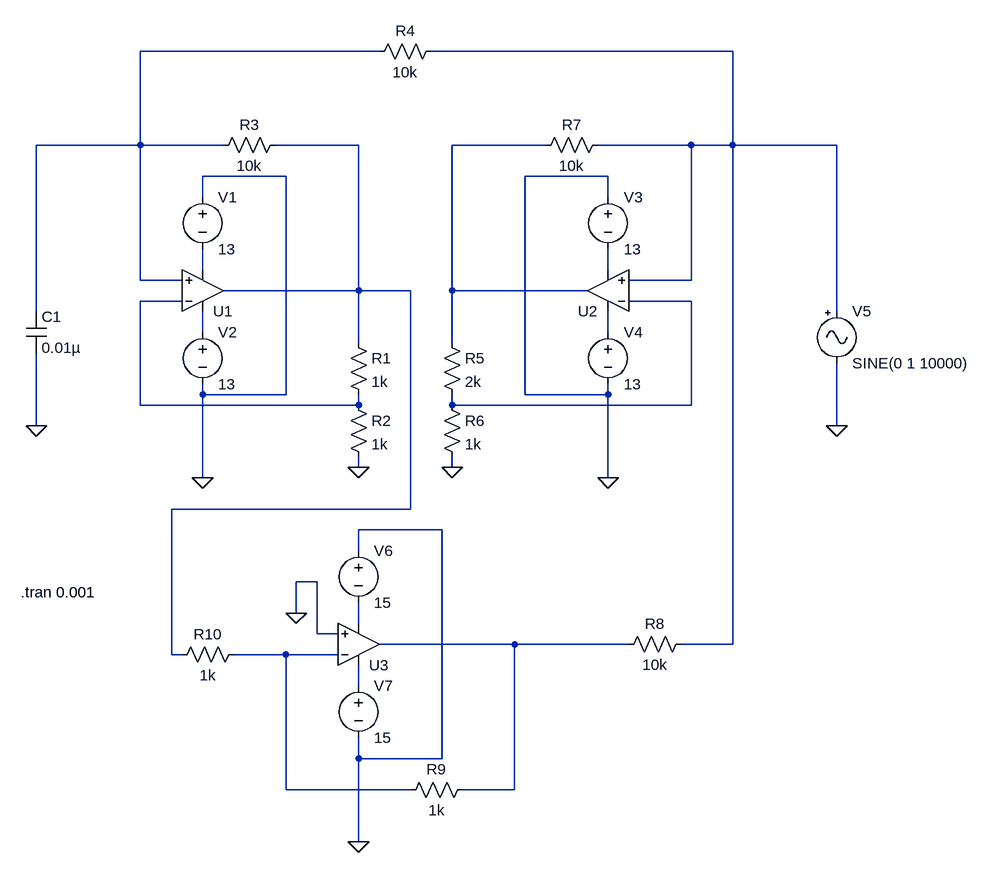
[diagram p0: schematic Gyrator.asc]
Gyrator.asc, the LTspice schematic file:
Version 4
SHEET 1 1372 1112
WIRE 448 -224 80 -224
WIRE 992 -224 528 -224
WIRE 80 -80 80 -224
WIRE 80 -80 -80 -80
WIRE 208 -80 80 -80
WIRE 416 -80 288 -80
WIRE 704 -80 560 -80
WIRE 928 -80 784 -80
WIRE 992 -80 992 -224
WIRE 992 -80 928 -80
WIRE 1152 -80 992 -80
WIRE 304 -32 176 -32
WIRE 800 -32 672 -32
WIRE 176 0 176 -32
WIRE 800 0 800 -32
WIRE 176 112 176 80
WIRE 800 112 800 80
WIRE 80 128 80 -80
WIRE 144 128 80 128
WIRE 928 128 928 -80
WIRE 928 128 832 128
WIRE 416 144 416 -80
WIRE 416 144 208 144
WIRE 496 144 416 144
WIRE 560 144 560 -80
WIRE 768 144 560 144
WIRE 144 160 80 160
WIRE 928 160 832 160
WIRE -80 176 -80 -80
WIRE 1152 176 1152 -80
WIRE 176 208 176 176
WIRE 800 208 800 176
WIRE 416 224 416 144
WIRE 560 224 560 144
WIRE 176 304 176 288
WIRE 304 304 304 -32
WIRE 304 304 176 304
WIRE 672 304 672 -32
WIRE 800 304 800 288
WIRE 800 304 672 304
WIRE 80 320 80 160
WIRE 416 320 416 304
WIRE 416 320 80 320
WIRE 560 320 560 304
WIRE 928 320 928 160
WIRE 928 320 560 320
WIRE -80 352 -80 240
WIRE 1152 352 1152 256
WIRE 416 416 416 400
WIRE 560 416 560 400
WIRE 176 432 176 304
WIRE 800 432 800 304
WIRE 496 480 496 144
WIRE 496 480 128 480
WIRE 544 512 416 512
WIRE 416 544 416 512
WIRE 352 592 320 592
WIRE 320 640 320 592
WIRE 416 656 416 624
WIRE 352 672 352 592
WIRE 384 672 352 672
WIRE 656 688 448 688
WIRE 832 688 656 688
WIRE 992 688 992 -80
WIRE 992 688 912 688
WIRE 128 704 128 480
WIRE 144 704 128 704
WIRE 304 704 224 704
WIRE 384 704 304 704
WIRE 416 752 416 720
WIRE 416 864 416 832
WIRE 544 864 544 512
WIRE 544 864 416 864
WIRE 304 912 304 704
WIRE 496 912 304 912
WIRE 656 912 656 688
WIRE 656 912 576 912
WIRE 416 992 416 864
FLAG 176 432 0
FLAG 800 432 0
FLAG 416 992 0
FLAG 320 640 0
FLAG 560 416 0
FLAG 416 416 0
FLAG 1152 352 0
FLAG -80 352 0
SYMBOL OpAmps\\UniversalOpamp2 176 144 M180
SYMATTR InstName U1
SYMBOL voltage 176 -16 R0
WINDOW 123 0 0 Left 0
WINDOW 39 0 0 Left 0
SYMATTR InstName V1
SYMATTR Value 13
SYMBOL voltage 176 192 R0
WINDOW 123 0 0 Left 0
WINDOW 39 0 0 Left 0
SYMATTR InstName V2
SYMATTR Value 13
SYMBOL res 400 208 R0
SYMATTR InstName R1
SYMATTR Value 1k
SYMBOL res 400 304 R0
SYMATTR InstName R2
SYMATTR Value 1k
SYMBOL res 304 -96 R90
WINDOW 0 0 56 VBottom 2
WINDOW 3 32 56 VTop 2
SYMATTR InstName R3
SYMATTR Value 10k
SYMBOL cap -96 176 R0
SYMATTR InstName C1
SYMATTR Value 0.01µ
SYMBOL res 544 -240 R90
WINDOW 0 0 56 VBottom 2
WINDOW 3 32 56 VTop 2
SYMATTR InstName R4
SYMATTR Value 10k
SYMBOL OpAmps\\UniversalOpamp2 800 144 R180
SYMATTR InstName U2
SYMBOL voltage 800 -16 R0
WINDOW 123 0 0 Left 0
WINDOW 39 0 0 Left 0
SYMATTR InstName V3
SYMATTR Value 13
SYMBOL voltage 800 192 R0
WINDOW 123 0 0 Left 0
WINDOW 39 0 0 Left 0
SYMATTR InstName V4
SYMATTR Value 13
SYMBOL res 544 208 R0
SYMATTR InstName R5
SYMATTR Value 2k
SYMBOL res 544 304 R0
SYMATTR InstName R6
SYMATTR Value 1k
SYMBOL res 800 -96 R90
WINDOW 0 0 56 VBottom 2
WINDOW 3 32 56 VTop 2
SYMATTR InstName R7
SYMATTR Value 10k
SYMBOL Misc\\signal 1152 160 R0
WINDOW 123 0 0 Left 0
WINDOW 39 0 0 Left 0
SYMATTR InstName V5
SYMATTR Value SINE(0 1 10000)
SYMBOL res 928 672 R90
WINDOW 0 0 56 VBottom 2
WINDOW 3 32 56 VTop 2
SYMATTR InstName R8
SYMATTR Value 10k
SYMBOL OpAmps\\UniversalOpamp2 416 688 M180
SYMATTR InstName U3
SYMBOL voltage 416 528 R0
WINDOW 123 0 0 Left 0
WINDOW 39 0 0 Left 0
SYMATTR InstName V6
SYMATTR Value 15
SYMBOL voltage 416 736 R0
WINDOW 123 0 0 Left 0
WINDOW 39 0 0 Left 0
SYMATTR InstName V7
SYMATTR Value 15
SYMBOL res 592 896 R90
WINDOW 0 0 56 VBottom 2
WINDOW 3 32 56 VTop 2
SYMATTR InstName R9
SYMATTR Value 1k
SYMBOL res 240 688 R90
WINDOW 0 0 56 VBottom 2
WINDOW 3 32 56 VTop 2
SYMATTR InstName R10
SYMATTR Value 1k
TEXT -104 608 Left 2 !.tran 0.001

The netlist it stands for:
* Gyrator.asc
XU1 N001 N007 N009 N005 N003 level.2 Avol=1Meg GBW=10Meg Slew=10Meg ilimit=25m rail=0 Vos=0 phimargin=45 en=0 enk=0 in=0 ink=0 Rin=500Meg  ; pins IN+ IN- V+ V- OUT
V1 0 N005 13
V2 N009 0 13
R1 N003 N007 1k
R2 N007 0 1k
R3 N003 N001 10k
C1 N001 0 0.01µ
R4 N002 N001 10k
XU2 N002 N008 N010 N006 N004 level.2 Avol=1Meg GBW=10Meg Slew=10Meg ilimit=25m rail=0 Vos=0 phimargin=45 en=0 enk=0 in=0 ink=0 Rin=500Meg  ; pins IN+ IN- V+ V- OUT
V3 0 N006 13
V4 N010 0 13
R5 N004 N008 2k
R6 N008 0 1k
R7 N002 N004 10k
V5 N002 0 SINE(0 1 10000)
R8 N002 N012 10k
XU3 0 N013 N014 N011 N012 level.2 Avol=1Meg GBW=10Meg Slew=10Meg ilimit=25m rail=0 Vos=0 phimargin=45 en=0 enk=0 in=0 ink=0 Rin=500Meg  ; pins IN+ IN- V+ V- OUT
V6 0 N011 15
V7 N014 0 15
R9 N012 N013 1k
R10 N013 N003 1k
.tran 0.001
.lib UniversalOpamps2.sub
.backanno
.end